# Altium schematic sheet Programming USB.SchDoc
size A
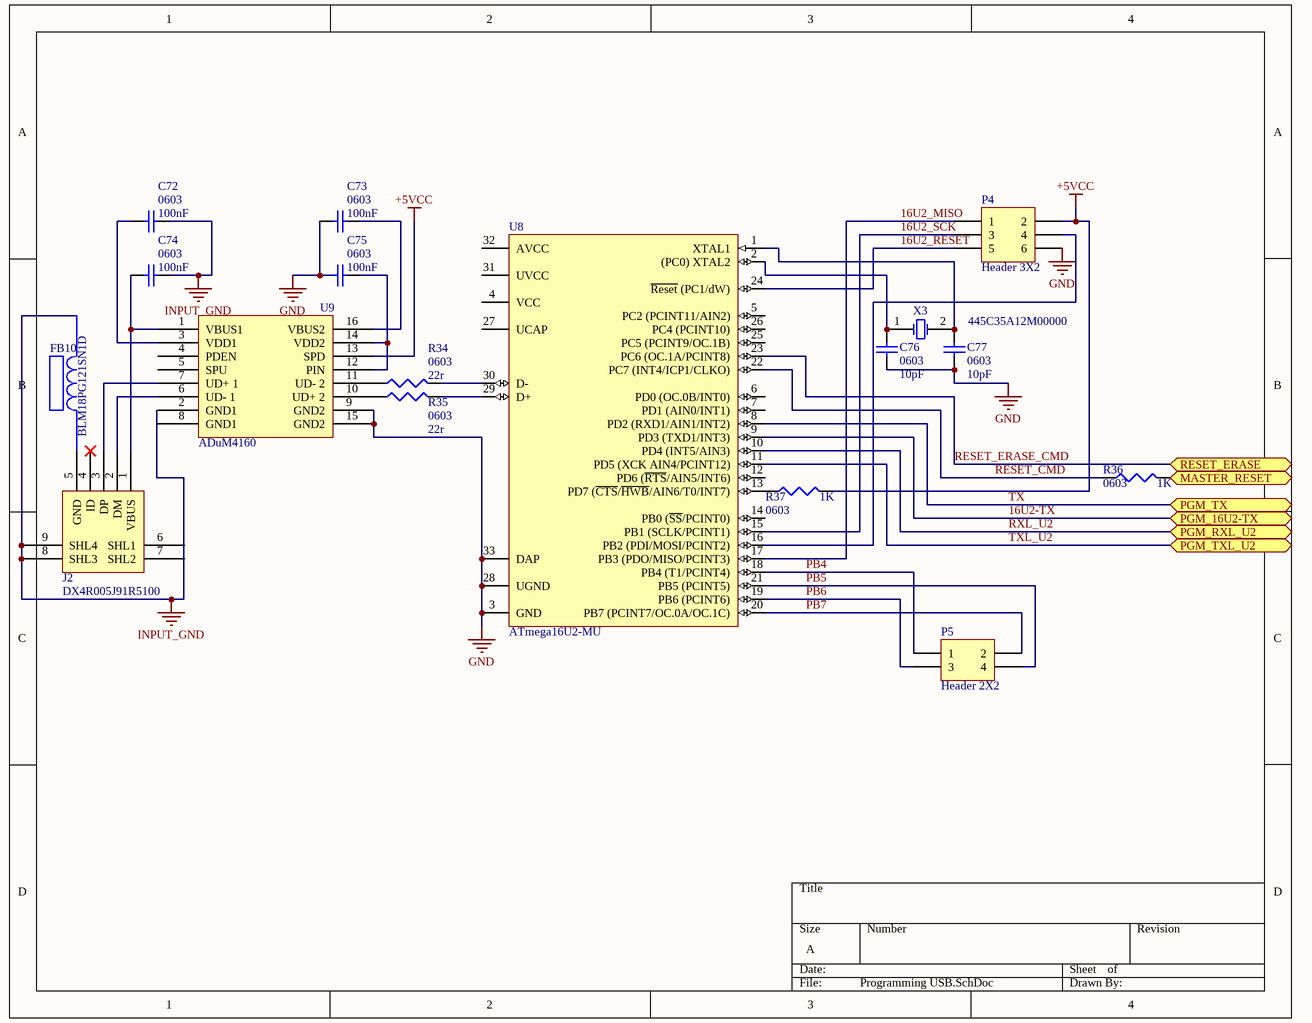
[diagram p0: Programming USB.SchDoc]

## Parts
C72  0603  value 100nF  [1608[0603]]
C73  0603  value 100nF  [1608[0603]]
C74  0603  value 100nF  [1608[0603]]
C75  0603  value 100nF  [1608[0603]]
C76  0603  value 10pF  [1608[0603]]
C77  0603  value 10pF  [1608[0603]]
FB10  BLM18PG121SN1D  [BLM18PG121SN1D]
J2  DX4R005J91R5100  [Micro USB Circular Holes Only]
P4  Header 3X2  [HDR2X3]
P5  Header 2X2  [HDR2X2]
R34  0603  value 22r  [J1-0603]
R35  0603  value 22r  [J1-0603]
R36  0603  value 1K  [J1-0603]
R37  0603  value 1K  [J1-0603]
U8  ATmega16U2-MU  [32PG_L]
U9  ADuM4160  [ADuM4160]
X3  445C35A12M00000  [R38]

## Ports
MASTER_RESET, PGM_16U2-TX, PGM_RXL_U2, PGM_TX, PGM_TXL_U2, RESET_ERASE

## Nets
+5VCC: P4.2 R37.2 U9.13(SPD)
GND: C73.2 C75.2 C76.1 C77.1 P4.6 U8.3(GND) U8.28(UGND) U8.33(DAP) U9.9(GND2) U9.15(GND2)
INPUT_GND: C72.1 C74.1 FB10.2 J2.8(SHL3) J2.9(SHL4)
16U2-TX: U8.9(PD3_(TXD1/INT3)) ; port PGM_16U2-TX
16U2_MISO: P4.1 U8.17(PB3_(PDO/MISO/PCINT3))
16U2_RESET: P4.5 U8.24(~{Reset}_(PC1/dW))
16U2_SCK: P4.3 U8.15(PB1_(SCLK/PCINT1))
MASTER_RESET: R36.2 ; port MASTER_RESET
PB4: P5.1 U8.18(PB4_(T1/PCINT4))
PB5: P5.4 U8.21(PB5_(PCINT5))
PB6: P5.3 U8.19(PB6_(PCINT6))
PB7: P5.2 U8.20(PB7_(PCINT7/OC.0A/OC.1C))
RESET_CMD: R36.1 U8.22(PC7_(INT4/ICP1/CLKO))
RESET_ERASE_CMD: U8.23(PC6_(OC.1A/PCINT8)) ; port RESET_ERASE
RXL_U2: U8.10(PD4_(INT5/AIN3)) ; port PGM_RXL_U2
TX: U8.8(PD2_(RXD1/AIN1/INT2)) ; port PGM_TX
TXL_U2: U8.11(PD5_(XCK_AIN4/PCINT12)) ; port PGM_TXL_U2
NetC72_2: C72.2 U9.3(VDD1)
NetC73_1: C73.1 U9.16(VBUS2)
NetC74_2: C74.2 J2.1(VBUS) U9.1(VBUS1)
NetC75_1: C75.1 U9.12(PIN) U9.14(VDD2)
NetC76_2: C76.2 U8.2((PC0)_XTAL2) X3.1(OSC1)
NetC77_2: C77.2 U8.1(XTAL1) X3.2(OSC2)
NetFB10_1: FB10.1 J2.5(GND)
NetJ2_2: J2.2(DM) U9.6(UD-_1)
NetJ2_3: J2.3(DP) U9.7(UD+_1)
NetP4_4: P4.4 U8.16(PB2_(PDI/MOSI/PCINT2))
NetR34_1: R34.1 U9.11(UD-_2)
NetR34_2: R34.2 U8.30(D-)
NetR35_1: R35.1 U9.10(UD+_2)
NetR35_2: R35.2 U8.29(D+)
NetR37_1: R37.1 U8.13(PD7_(~{CTS}/~{HWB}/AIN6/T0/INT7))

Not connected (* = marked no-connect by the designer): J2 4(ID)* 6(SHL1) 7(SHL2); U8 4(VCC) 5(PC2_(PCINT11/AIN2)) 6(PD0_(OC.0B/INT0)) 7(PD1_(AIN0/INT1)) 12(PD6_(~{RTS}/AIN5/INT6)) 14(PB0_(~{SS}/PCINT0)) 25(PC5_(PCINT9/OC.1B)) 26(PC4_(PCINT10)) 27(UCAP) 31(UVCC) 32(AVCC); U9 2(GND1) 4(PDEN) 5(SPU) 8(GND1)

## Library data of the parts
C72-C77 = Cap Semi: Capacitor (Semiconductor SIM Model); Published: 8-Jun-2000; LatestRevisionDate: 29-May-2009; LatestRevisionNote: IPC-7351 Footprint Added.; PackageReference: C1206; Publisher: Altium Limited; PackageDescription: Chip Capacitor
J2 = Micro USB: Micro USB Jack B
P4 = Header 3X2: Header, 3-Pin, Dual row; LatestRevisionDate: 17-Jul-2002; LatestRevisionNote: Re-released for DXP Platform.; Publisher: Altium Limited
P5 = Header 2X2: Header, 2-Pin, Dual row; LatestRevisionDate: 17-Jul-2002; LatestRevisionNote: Re-released for DXP Platform.; Publisher: Altium Limited
R34-R37 = Res3: Resistor; Published: 8-Jun-2000; LatestRevisionDate: 29-May-2009; LatestRevisionNote: IPC-7351 Footprint Added.; PackageReference: J1-0603; Publisher: Altium Limited; PackageDescription: Chip Resistor
U8 = ATmega16U2-MU: 8-bit AVR Microcontroller, 2.7-5.5V, 16KB Flash, 512 Bytes EEPROM, 512 Bytes SRAM, 32-pin VQFN, Industrial Grade (-40°C to 85°C); DatasheetVersion: revD, Nov-2010; PackageVersion: revA, Oct-2008; PackageReference: 32PG; PackageDescription: 32-Pin Quad Flat No-Lead (QFN) Sawn,  5 x 5 x 1.0 mm Body, Pitch 0.50 mm, 3.60mm Exposed Pad; Code_JEDEC: MO-220WHHD-2; ComponentLink1Description: Manufacturer URL; ComponentLink1URL: http://www.atmel.com/; ComponentLink2Description: ATmega8U2/16U2/32U2 Datasheet; ComponentLink2URL: http://www.atmel.com/dyn/resources/prod_documents/doc7799.pdf; ComponentLink3Description: ATmega8U2/16U2/32U2 Summary; ComponentLink3URL: http://www.atmel.com/dyn/resources/prod_documents/7799S.pdf
U9 = ADuM4160: USB Opto Isolator
X3 = XTAL: Crystal Oscillator; Published: 8-Jun-2000; LatestRevisionDate: 17-Jul-2002; LatestRevisionNote: Re-released for DXP Platform.; PackageReference: R38; Publisher: Altium Limited; PackageDescription: Crystal, Thru-Hole; 2 Leads; Body 3.1 x 8.2 mm (Dia.xH)